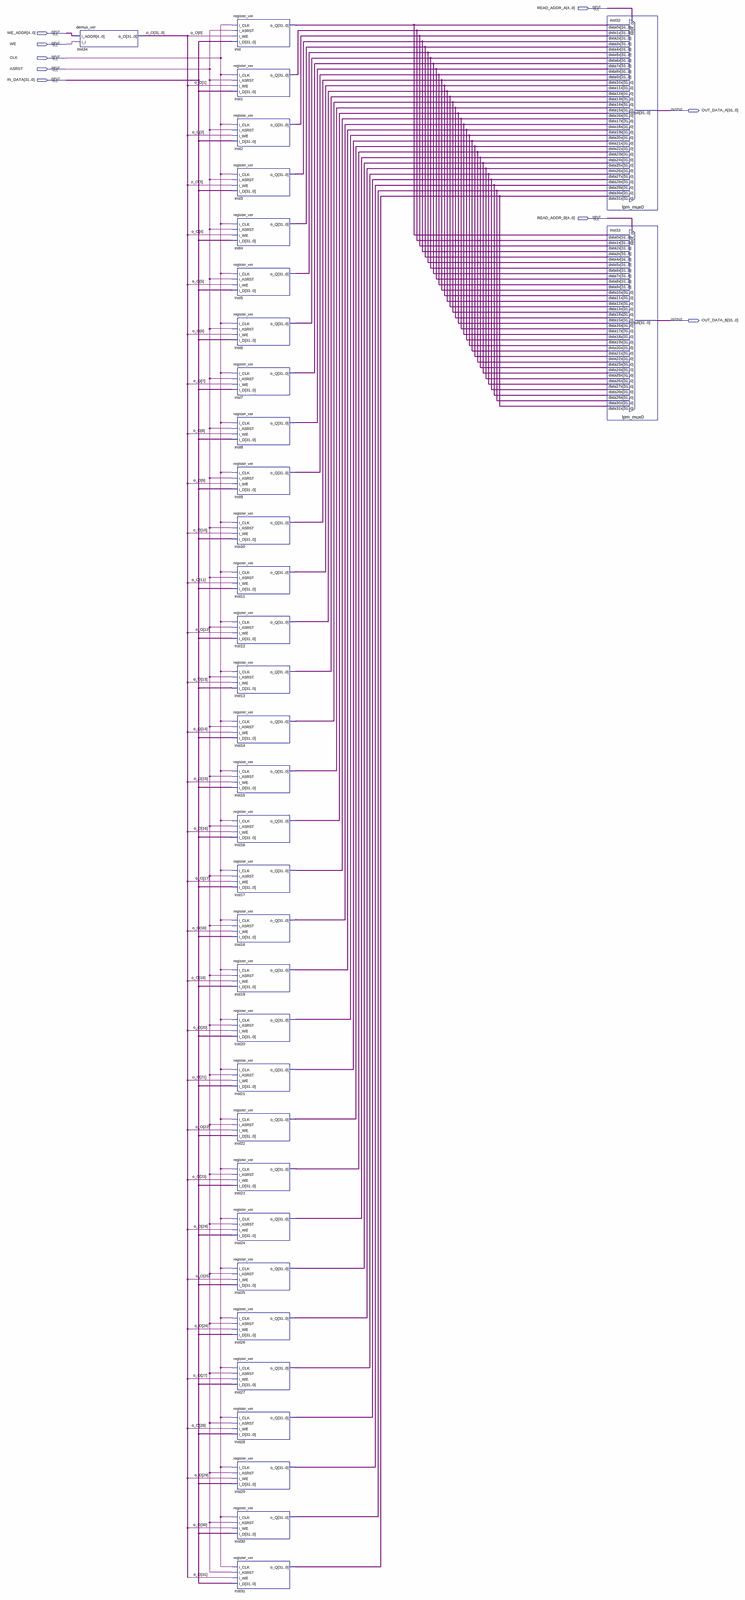
[diagram p0: schematic sheet, whole]
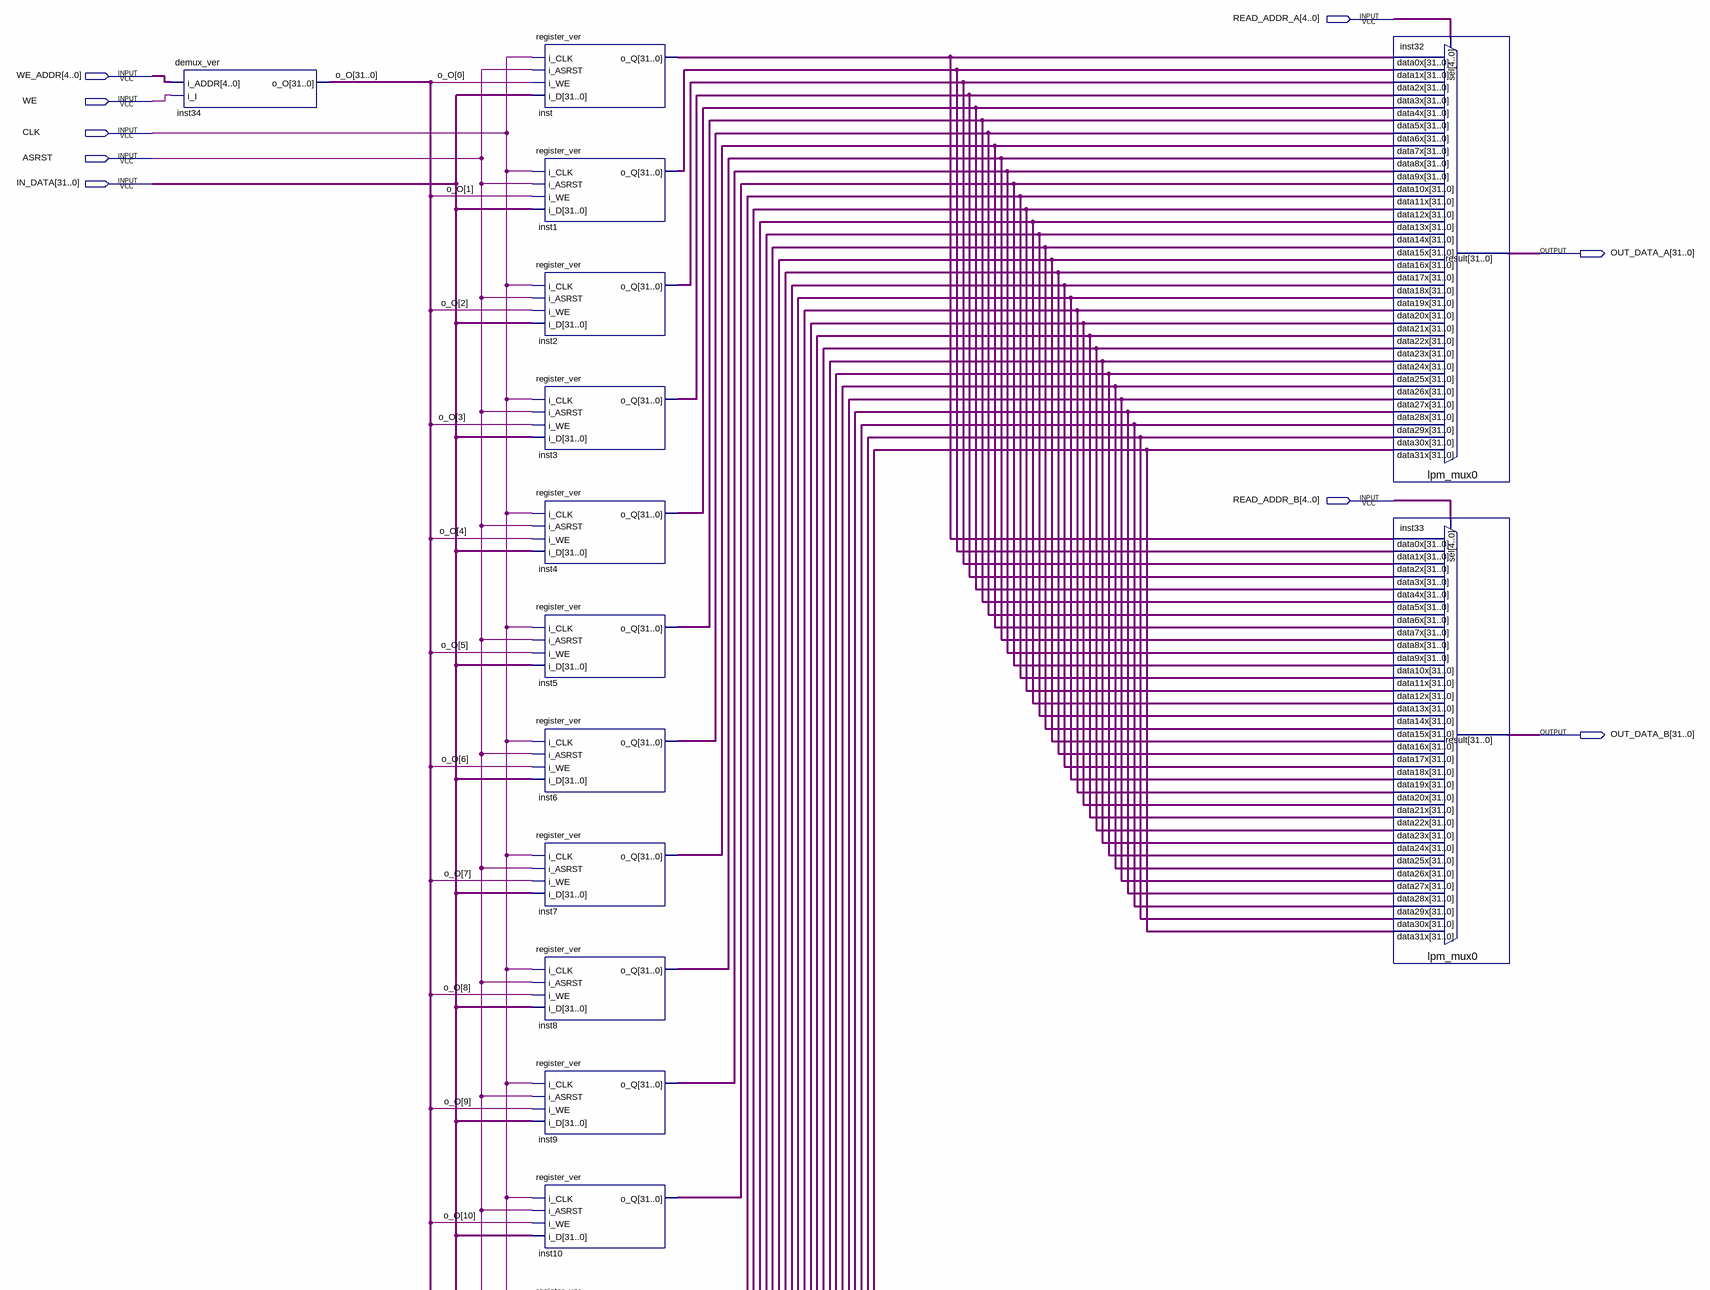
[diagram p1: schematic sheet, upper part]
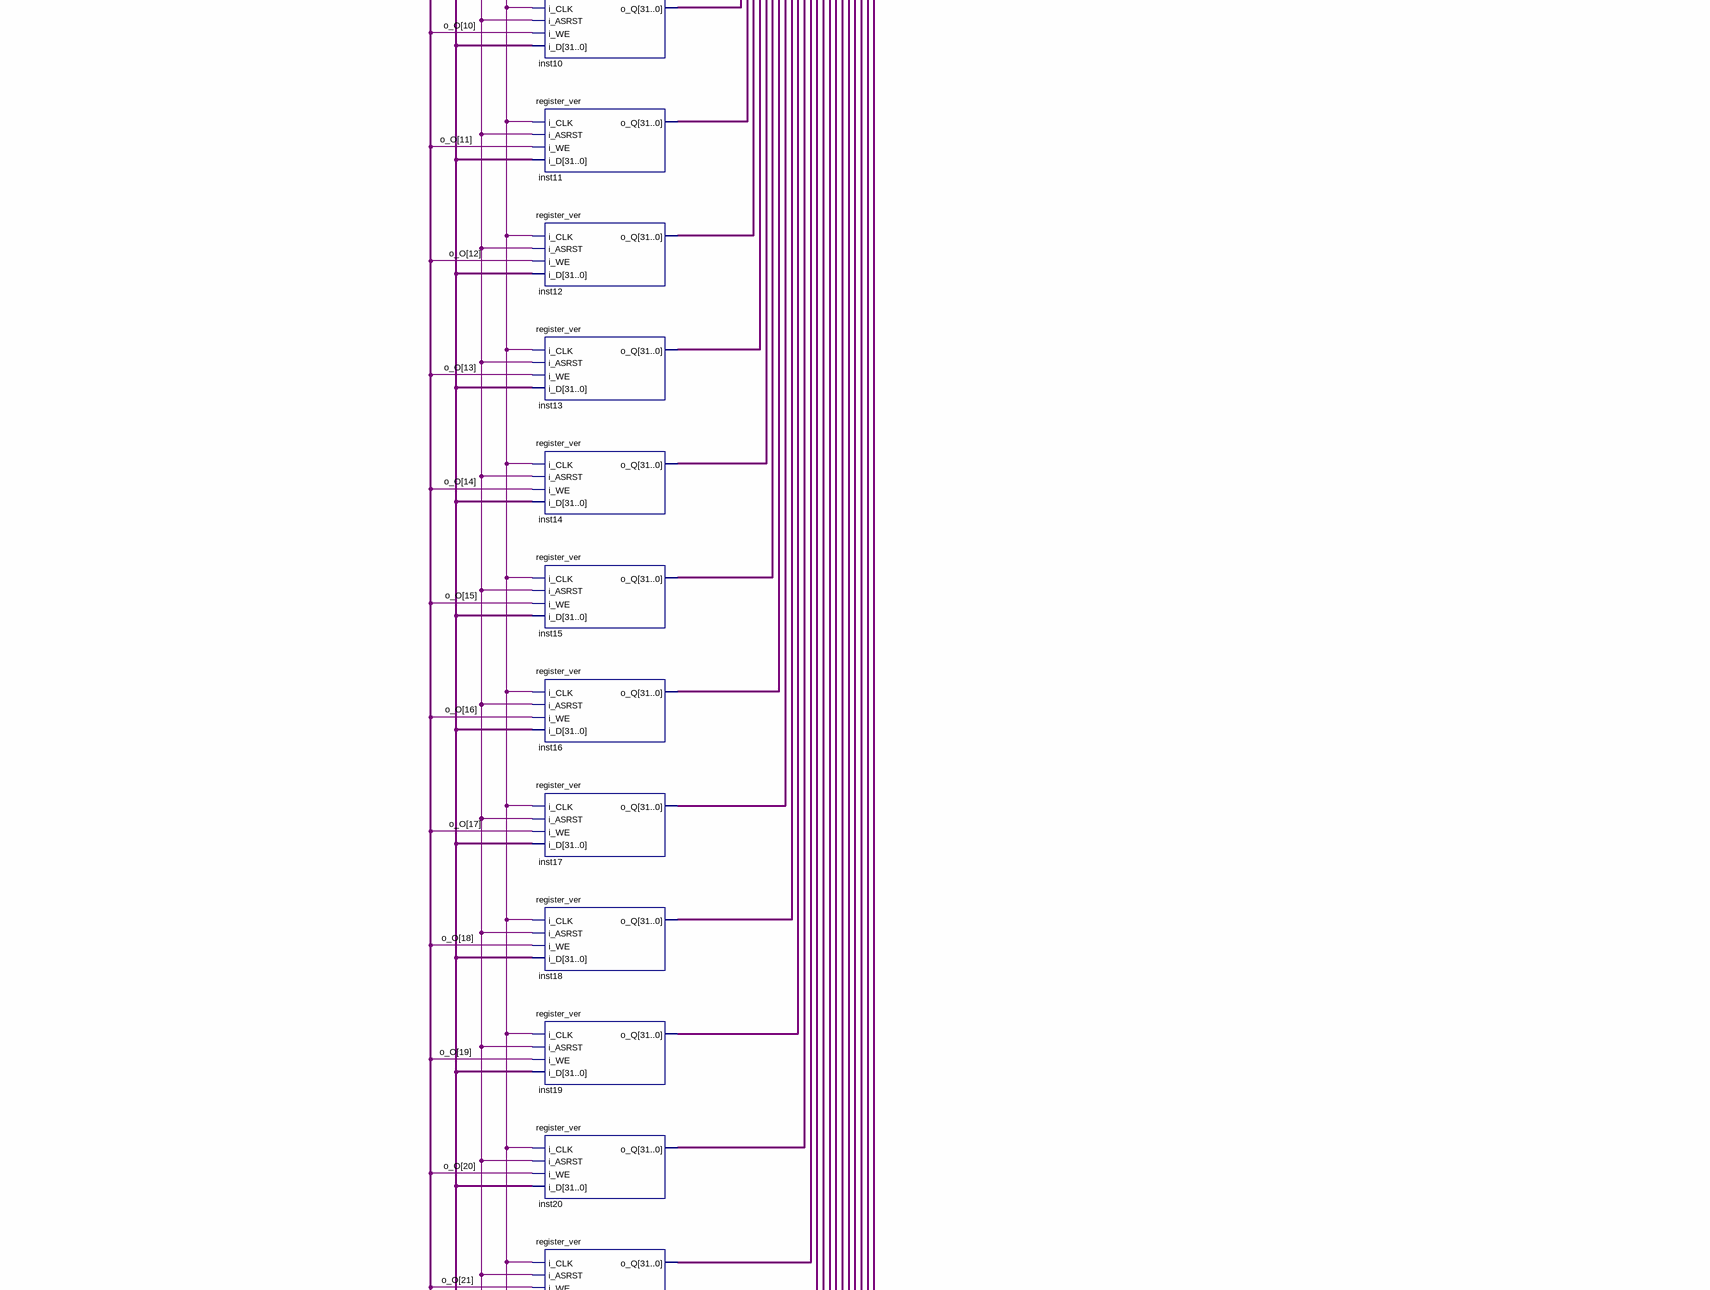
[diagram p2: schematic sheet, middle part]
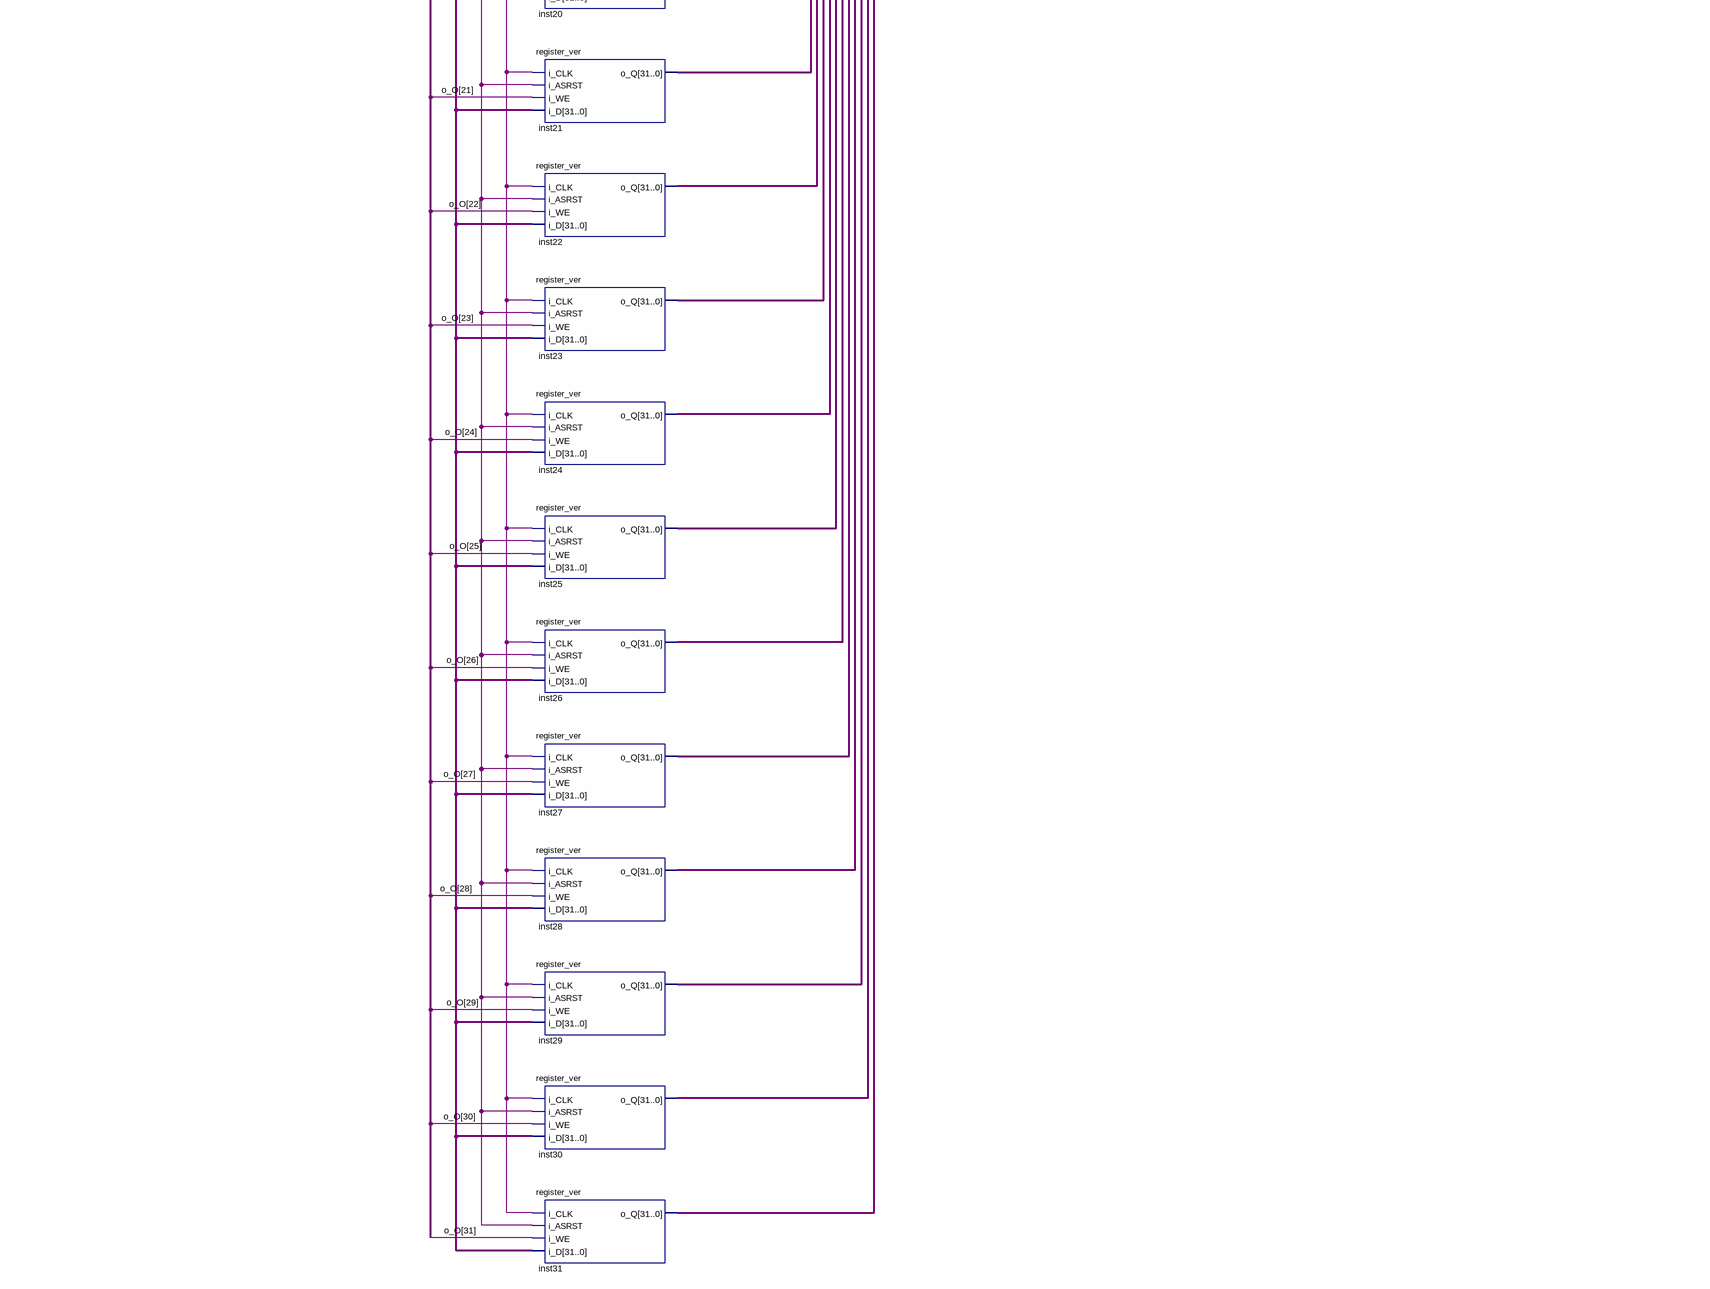
[diagram p3: schematic sheet, lower part]
// Quartus schematic register_file.bdf as structural Verilog: 35 symbols, 9 pins
module register_file (
  input  [4:0] READ_ADDR_A,
  input  [4:0] WE_ADDR,
  input  WE,
  input  CLK,
  input  ASRST,
  input  [31:0] IN_DATA,
  input  [4:0] READ_ADDR_B,
  output [31:0] OUT_DATA_A,
  output [31:0] OUT_DATA_B
);

  wire [31:0] inst1_o_q, inst2_o_q, inst3_o_q, inst4_o_q, inst5_o_q, inst6_o_q, inst7_o_q, inst8_o_q,
       inst9_o_q, inst10_o_q, inst11_o_q, inst12_o_q, inst13_o_q, inst14_o_q, inst15_o_q, inst16_o_q,
       inst17_o_q, inst18_o_q, inst19_o_q, inst20_o_q, inst21_o_q, inst22_o_q, inst23_o_q, inst24_o_q,
       inst25_o_q, inst26_o_q, inst27_o_q, inst28_o_q, inst29_o_q, inst30_o_q, inst31_o_q, inst_o_q, o_O;

  demux_ver inst34 (.i_ADDR(WE_ADDR), .i_I(WE), .o_O(o_O));
  register_ver inst (.i_CLK(CLK), .i_ASRST(ASRST), .i_WE(o_O[0]), .i_D(IN_DATA), .o_Q(inst_o_q));
  register_ver inst1 (.i_CLK(CLK), .i_ASRST(ASRST), .i_WE(o_O[1]), .i_D(IN_DATA), .o_Q(inst1_o_q));
  register_ver inst2 (.i_CLK(CLK), .i_ASRST(ASRST), .i_WE(o_O[2]), .i_D(IN_DATA), .o_Q(inst2_o_q));
  register_ver inst3 (.i_CLK(CLK), .i_ASRST(ASRST), .i_WE(o_O[3]), .i_D(IN_DATA), .o_Q(inst3_o_q));
  register_ver inst4 (.i_CLK(CLK), .i_ASRST(ASRST), .i_WE(o_O[4]), .i_D(IN_DATA), .o_Q(inst4_o_q));
  register_ver inst5 (.i_CLK(CLK), .i_ASRST(ASRST), .i_WE(o_O[5]), .i_D(IN_DATA), .o_Q(inst5_o_q));
  register_ver inst6 (.i_CLK(CLK), .i_ASRST(ASRST), .i_WE(o_O[6]), .i_D(IN_DATA), .o_Q(inst6_o_q));
  register_ver inst7 (.i_CLK(CLK), .i_ASRST(ASRST), .i_WE(o_O[7]), .i_D(IN_DATA), .o_Q(inst7_o_q));
  register_ver inst8 (.i_CLK(CLK), .i_ASRST(ASRST), .i_WE(o_O[8]), .i_D(IN_DATA), .o_Q(inst8_o_q));
  register_ver inst9 (.i_CLK(CLK), .i_ASRST(ASRST), .i_WE(o_O[9]), .i_D(IN_DATA), .o_Q(inst9_o_q));
  register_ver inst10 (.i_CLK(CLK), .i_ASRST(ASRST), .i_WE(o_O[10]), .i_D(IN_DATA), .o_Q(inst10_o_q));
  register_ver inst11 (.i_CLK(CLK), .i_ASRST(ASRST), .i_WE(o_O[11]), .i_D(IN_DATA), .o_Q(inst11_o_q));
  register_ver inst12 (.i_CLK(CLK), .i_ASRST(ASRST), .i_WE(o_O[12]), .i_D(IN_DATA), .o_Q(inst12_o_q));
  register_ver inst13 (.i_CLK(CLK), .i_ASRST(ASRST), .i_WE(o_O[13]), .i_D(IN_DATA), .o_Q(inst13_o_q));
  register_ver inst14 (.i_CLK(CLK), .i_ASRST(ASRST), .i_WE(o_O[14]), .i_D(IN_DATA), .o_Q(inst14_o_q));
  register_ver inst15 (.i_CLK(CLK), .i_ASRST(ASRST), .i_WE(o_O[15]), .i_D(IN_DATA), .o_Q(inst15_o_q));
  register_ver inst16 (.i_CLK(CLK), .i_ASRST(ASRST), .i_WE(o_O[16]), .i_D(IN_DATA), .o_Q(inst16_o_q));
  register_ver inst17 (.i_CLK(CLK), .i_ASRST(ASRST), .i_WE(o_O[17]), .i_D(IN_DATA), .o_Q(inst17_o_q));
  register_ver inst18 (.i_CLK(CLK), .i_ASRST(ASRST), .i_WE(o_O[18]), .i_D(IN_DATA), .o_Q(inst18_o_q));
  register_ver inst19 (.i_CLK(CLK), .i_ASRST(ASRST), .i_WE(o_O[19]), .i_D(IN_DATA), .o_Q(inst19_o_q));
  register_ver inst20 (.i_CLK(CLK), .i_ASRST(ASRST), .i_WE(o_O[20]), .i_D(IN_DATA), .o_Q(inst20_o_q));
  register_ver inst21 (.i_CLK(CLK), .i_ASRST(ASRST), .i_WE(o_O[21]), .i_D(IN_DATA), .o_Q(inst21_o_q));
  register_ver inst22 (.i_CLK(CLK), .i_ASRST(ASRST), .i_WE(o_O[22]), .i_D(IN_DATA), .o_Q(inst22_o_q));
  register_ver inst23 (.i_CLK(CLK), .i_ASRST(ASRST), .i_WE(o_O[23]), .i_D(IN_DATA), .o_Q(inst23_o_q));
  register_ver inst24 (.i_CLK(CLK), .i_ASRST(ASRST), .i_WE(o_O[24]), .i_D(IN_DATA), .o_Q(inst24_o_q));
  register_ver inst25 (.i_CLK(CLK), .i_ASRST(ASRST), .i_WE(o_O[25]), .i_D(IN_DATA), .o_Q(inst25_o_q));
  register_ver inst26 (.i_CLK(CLK), .i_ASRST(ASRST), .i_WE(o_O[26]), .i_D(IN_DATA), .o_Q(inst26_o_q));
  register_ver inst27 (.i_CLK(CLK), .i_ASRST(ASRST), .i_WE(o_O[27]), .i_D(IN_DATA), .o_Q(inst27_o_q));
  register_ver inst28 (.i_CLK(CLK), .i_ASRST(ASRST), .i_WE(o_O[28]), .i_D(IN_DATA), .o_Q(inst28_o_q));
  register_ver inst29 (.i_CLK(CLK), .i_ASRST(ASRST), .i_WE(o_O[29]), .i_D(IN_DATA), .o_Q(inst29_o_q));
  register_ver inst30 (.i_CLK(CLK), .i_ASRST(ASRST), .i_WE(o_O[30]), .i_D(IN_DATA), .o_Q(inst30_o_q));
  register_ver inst31 (.i_CLK(CLK), .i_ASRST(ASRST), .i_WE(o_O[31]), .i_D(IN_DATA), .o_Q(inst31_o_q));
  lpm_mux0 inst32 (
    .data31x(inst31_o_q), .data30x(inst30_o_q), .data29x(inst29_o_q), .data28x(inst28_o_q),
    .data27x(inst27_o_q), .data26x(inst26_o_q), .data25x(inst25_o_q), .data24x(inst24_o_q),
    .data23x(inst23_o_q), .data22x(inst22_o_q), .data21x(inst21_o_q), .data20x(inst20_o_q),
    .data19x(inst19_o_q), .data18x(inst18_o_q), .data17x(inst17_o_q), .data16x(inst16_o_q),
    .data15x(inst15_o_q), .data14x(inst14_o_q), .data13x(inst13_o_q), .data12x(inst12_o_q),
    .data11x(inst11_o_q), .data10x(inst10_o_q), .data9x(inst9_o_q), .data8x(inst8_o_q), .data7x(inst7_o_q),
    .data6x(inst6_o_q), .data5x(inst5_o_q), .data4x(inst4_o_q), .data3x(inst3_o_q), .data2x(inst2_o_q),
    .data1x(inst1_o_q), .data0x(inst_o_q), .sel(READ_ADDR_A), .result(OUT_DATA_A));
  lpm_mux0 inst33 (
    .data31x(inst31_o_q), .data30x(inst30_o_q), .data29x(inst29_o_q), .data28x(inst28_o_q),
    .data27x(inst27_o_q), .data26x(inst26_o_q), .data25x(inst25_o_q), .data24x(inst24_o_q),
    .data23x(inst23_o_q), .data22x(inst22_o_q), .data21x(inst21_o_q), .data20x(inst20_o_q),
    .data19x(inst19_o_q), .data18x(inst18_o_q), .data17x(inst17_o_q), .data16x(inst16_o_q),
    .data15x(inst15_o_q), .data14x(inst14_o_q), .data13x(inst13_o_q), .data12x(inst12_o_q),
    .data11x(inst11_o_q), .data10x(inst10_o_q), .data9x(inst9_o_q), .data8x(inst8_o_q), .data7x(inst7_o_q),
    .data6x(inst6_o_q), .data5x(inst5_o_q), .data4x(inst4_o_q), .data3x(inst3_o_q), .data2x(inst2_o_q),
    .data1x(inst1_o_q), .data0x(inst_o_q), .sel(READ_ADDR_B), .result(OUT_DATA_B));
endmodule
